# Altium schematic sheet Hitachi100NZ.SchDoc: HITACHI HIGH SPEED IN M2M
size A4
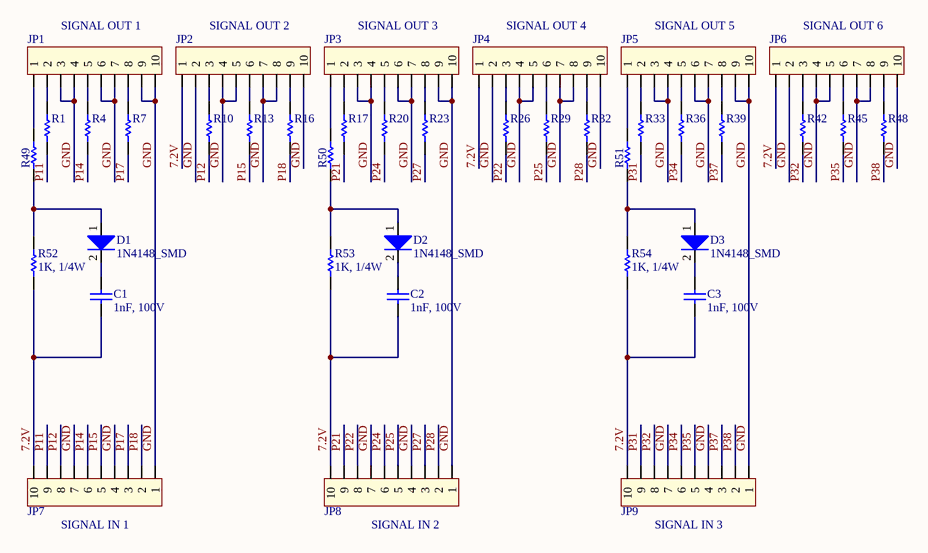
[diagram p0: Hitachi100NZ.SchDoc]

## Parts
C1  value 1nF, 100V  [C0603]  (hidden comment: 5AK102KABAA)
C2  value 1nF, 100V  [C0603]  (hidden comment: 5AK102KABAA)
C3  value 1nF, 100V  [C0603]  (hidden comment: 5AK102KABAA)
D1  1N4148_SMD  [1N4148W_V_SMD]
D2  1N4148_SMD  [1N4148W_V_SMD]
D3  1N4148_SMD  [1N4148W_V_SMD]
JP1  SIGNAL OUT 1  [HeaderSP_5x2]
JP2  SIGNAL OUT 2  [HeaderSP_5x2]
JP3  SIGNAL OUT 3  [HeaderSP_5x2]
JP4  SIGNAL OUT 4  [HeaderSP_5x2]
JP5  SIGNAL OUT 5  [HeaderSP_5x2]
JP6  SIGNAL OUT 6  [HeaderSP_5x2]
JP7  SIGNAL IN 1  [HeaderSP_5x2]
JP8  SIGNAL IN 2  [HeaderSP_5x2]
JP9  SIGNAL IN 3  [HeaderSP_5x2]
R1  CF1/4W1KJ25  [RM06JTN (0603)]  (value not drawn)
R4  CF1/4W1KJ25  [RM06JTN (0603)]  (value not drawn)
R7  CF1/4W1KJ25  [RM06JTN (0603)]  (value not drawn)
R10  CF1/4W1KJ25  [RM06JTN (0603)]  (value not drawn)
R13  CF1/4W1KJ25  [RM06JTN (0603)]  (value not drawn)
R16  CF1/4W1KJ25  [RM06JTN (0603)]  (value not drawn)
R17  CF1/4W1KJ25  [RM06JTN (0603)]  (value not drawn)
R20  CF1/4W1KJ25  [RM06JTN (0603)]  (value not drawn)
R23  CF1/4W1KJ25  [RM06JTN (0603)]  (value not drawn)
R26  CF1/4W1KJ25  [RM06JTN (0603)]  (value not drawn)
R29  CF1/4W1KJ25  [RM06JTN (0603)]  (value not drawn)
R32  CF1/4W1KJ25  [RM06JTN (0603)]  (value not drawn)
R33  CF1/4W1KJ25  [RM06JTN (0603)]  (value not drawn)
R36  CF1/4W1KJ25  [RM06JTN (0603)]  (value not drawn)
R39  CF1/4W1KJ25  [RM06JTN (0603)]  (value not drawn)
R42  CF1/4W1KJ25  [RM06JTN (0603)]  (value not drawn)
R45  CF1/4W1KJ25  [RM06JTN (0603)]  (value not drawn)
R48  CF1/4W1KJ25  [RM06JTN (0603)]  (value not drawn)
R49  CF1/4W1KJ25  [RM06JTN (0603)]  (value not drawn)
R50  CF1/4W1KJ25  [RM06JTN (0603)]  (value not drawn)
R51  CF1/4W1KJ25  [RM06JTN (0603)]  (value not drawn)
R52  value 1K, 1/4W  [RM06JTN (0603)]  (hidden comment: CF1/4W1KJ25)
R53  value 1K, 1/4W  [RM06JTN (0603)]  (hidden comment: CF1/4W1KJ25)
R54  value 1K, 1/4W  [RM06JTN (0603)]  (hidden comment: CF1/4W1KJ25)

## Nets
7.2V: C1.1 C2.1 C3.1 JP2.1 JP4.1 JP6.1 JP7.10 JP8.10 JP9.10 R52.1 R53.1 R54.1
GND: JP1.3 JP1.4 JP1.6 JP1.7 JP1.9 JP1.10 JP2.2 JP2.4 JP2.5 JP2.7 JP2.8 JP2.10 JP3.3 JP3.4 JP3.6 JP3.7 JP3.9 JP3.10 JP4.2 JP4.4 JP4.5 JP4.7 JP4.8 JP4.10 JP5.3 JP5.4 JP5.6 JP5.7 JP5.9 JP5.10 JP6.2 JP6.4 JP6.5 JP6.7 JP6.8 JP6.10 JP7.1 JP7.4 JP7.7 JP8.1 JP8.4 JP8.7 JP9.1 JP9.4 JP9.7
P11: JP7.9 R1.1
P12: JP7.8 R10.1
P14: JP7.6 R4.1
P15: JP7.5 R13.1
P17: JP7.3 R7.1
P18: JP7.2 R16.1
P21: JP8.9 R17.1
P22: JP8.8 R26.1
P24: JP8.6 R20.1
P25: JP8.5 R29.1
P27: JP8.3 R23.1
P28: JP8.2 R32.1
P31: JP9.9 R33.1
P32: JP9.8 R42.1
P34: JP9.6 R36.1
P35: JP9.5 R45.1
P37: JP9.3 R39.1
P38: JP9.2 R48.1
NetC1_2: C1.2 D1.2(K)
NetC2_2: C2.2 D2.2(K)
NetC3_2: C3.2 D3.2(K)
NetD1_1: D1.1(A) R49.1 R52.2
NetD2_1: D2.1(A) R50.1 R53.2
NetD3_1: D3.1(A) R51.1 R54.2
NetJP1_1: JP1.1 R49.2
NetJP1_2: JP1.2 R1.2
NetJP1_5: JP1.5 R4.2
NetJP1_8: JP1.8 R7.2
NetJP2_3: JP2.3 R10.2
NetJP2_6: JP2.6 R13.2
NetJP2_9: JP2.9 R16.2
NetJP3_1: JP3.1 R50.2
NetJP3_2: JP3.2 R17.2
NetJP3_5: JP3.5 R20.2
NetJP3_8: JP3.8 R23.2
NetJP4_3: JP4.3 R26.2
NetJP4_6: JP4.6 R29.2
NetJP4_9: JP4.9 R32.2
NetJP5_1: JP5.1 R51.2
NetJP5_2: JP5.2 R33.2
NetJP5_5: JP5.5 R36.2
NetJP5_8: JP5.8 R39.2
NetJP6_3: JP6.3 R42.2
NetJP6_6: JP6.6 R45.2
NetJP6_9: JP6.9 R48.2

## Notes on the sheet
- Title
- Size:
- Date:
- A4
- Number:
- Time:
- Revision:
- Sheet
- of
- LẠI PHƯỚC SƠN
- Lpson.tth@gmail.com
- Lớp học ALTIUM
- File:

## Library data of the parts
C1-C3 = 5AK102KABAA: CAP NPO CAPNTO 1nF 100V 10%; ComponentLink1Description: Datasheet; ComponentLink1URL: D:\Dropbox\Datasheets\Passive Components\Capacitors\AVX Disc Ceramic Capacitors.pdf; Unit Price: 0.003
D1-D3 = 1N4148_SMD: Diode HS 500mA 100V SOD123; ComponentLink1Description: Datasheet; ComponentLink1URL: D:\Dropbox\Datasheets\Diodes and Rectifiers\Diodes\1N4148.pdf; Unit Price: 0.0038
JP1-JP9 = Con10: Connector 10; Value: Connector 10
R1 R4 R7 R10 R13 R16 R17 R20 R23 R26 R29 R32 R33 R36 R39 R42 R45 R48-R51 = CF1/4W1KJ25: RES CF AXIAL-0.3 5% 1/4W 1K; Value: 1K, 1/8W; Unit Price: 0.001; ComponentLink1Description: Datasheet; ComponentLink1URL: D:\Dropbox\Datasheets\Passive Components\Resistors\Carbon Film Resistor.pdf
R52-R54 = CF1/4W1KJ25: RES CF AXIAL-0.3 5% 1/4W 1K; Unit Price: 0.001; ComponentLink1Description: Datasheet; ComponentLink1URL: D:\Dropbox\Datasheets\Passive Components\Resistors\Carbon Film Resistor.pdf